# Altium schematic sheet ADC_UART_RX_V1.SchDoc
size A4
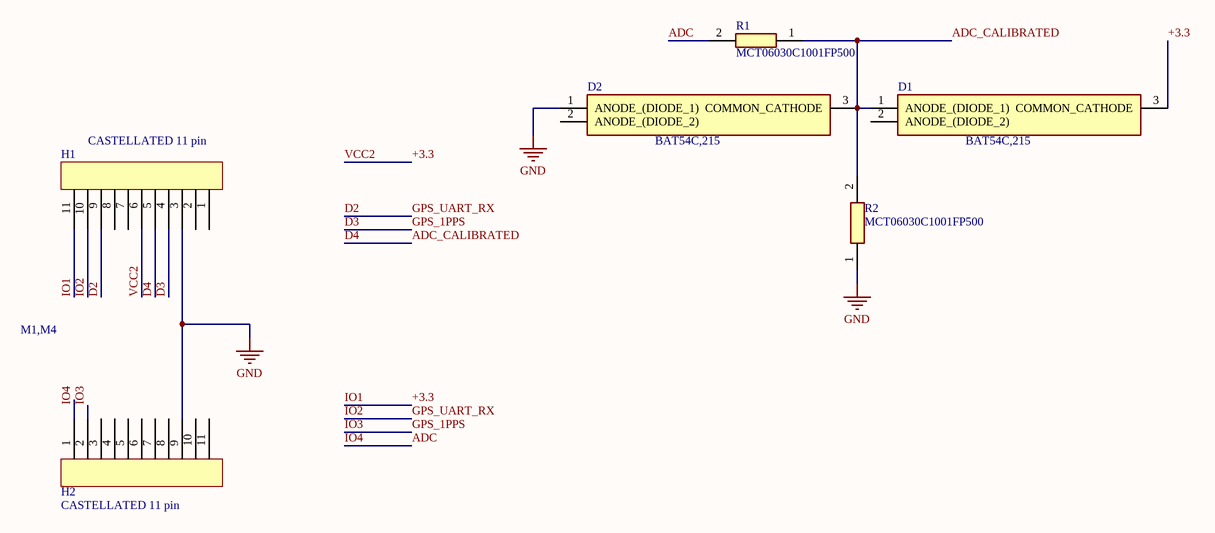
[diagram p0: ADC_UART_RX_V1.SchDoc]

## Parts
D1  BAT54C,215  [SOT95P230X110-3N]
D2  BAT54C,215  [SOT95P230X110-3N]
H1  CASTELLATED 11 pin  [CASTELLATED 11 pin]
H2  CASTELLATED 11 pin  [CASTELLATED 11 pin]
R1  MCT06030C1001FP500  [RESC1608X55N]
R2  MCT06030C1001FP500  [RESC1608X55N]

## Nets
GND: D2.1(ANODE_(DIODE_1)) H1.3 H2.9 R2.1
+3.3: D1.3(COMMON_CATHODE) H1.6 H1.11  [also labelled IO1, VCC2]
ADC: H2.1 R1.2  [also labelled IO4]
ADC_CALIBRATED: D1.1(ANODE_(DIODE_1)) D2.3(COMMON_CATHODE) H1.5 R1.1 R2.2  [also labelled D4]
D2: H1.9 H1.10  [also labelled GPS_UART_RX, IO2]
D3: H1.4 H2.2  [also labelled GPS_1PPS, IO3]

Not connected (* = marked no-connect by the designer): D1 2(ANODE_(DIODE_2)); D2 2(ANODE_(DIODE_2)); H1 1 2 7 8; H2 3 4 5 6 7 8 10 11

## Notes on the sheet
- M1,M4

## Library data of the parts
D1 D2 = BAT54C,215: Diode; Manufacturer_Name: Nexperia; Datasheet Link: https://componentsearchengine.com//BAT54C,215.pdf; Height: 1.1mm; Mouser2 Part Number: 771-BAT54C-T/R; Mouser2 Price/Stock: https://www.mouser.com/Search/Refine.aspx?Keyword=771-BAT54C-T%2FR; Manufacturer_Part_Number: BAT54C,215
R1 R2 = MCT06030C1001FP500: Resistor; Manufacturer_Name: Vishay; Datasheet Link: http://www.vishay.com/docs/28705/mcx0x0xpro.pdf; Height: 0.55mm; Manufacturer_Part_Number: MCT06030C1001FP500